# EAGLE design sk6812-24-12ring-in (EAGLE 7.5.0)
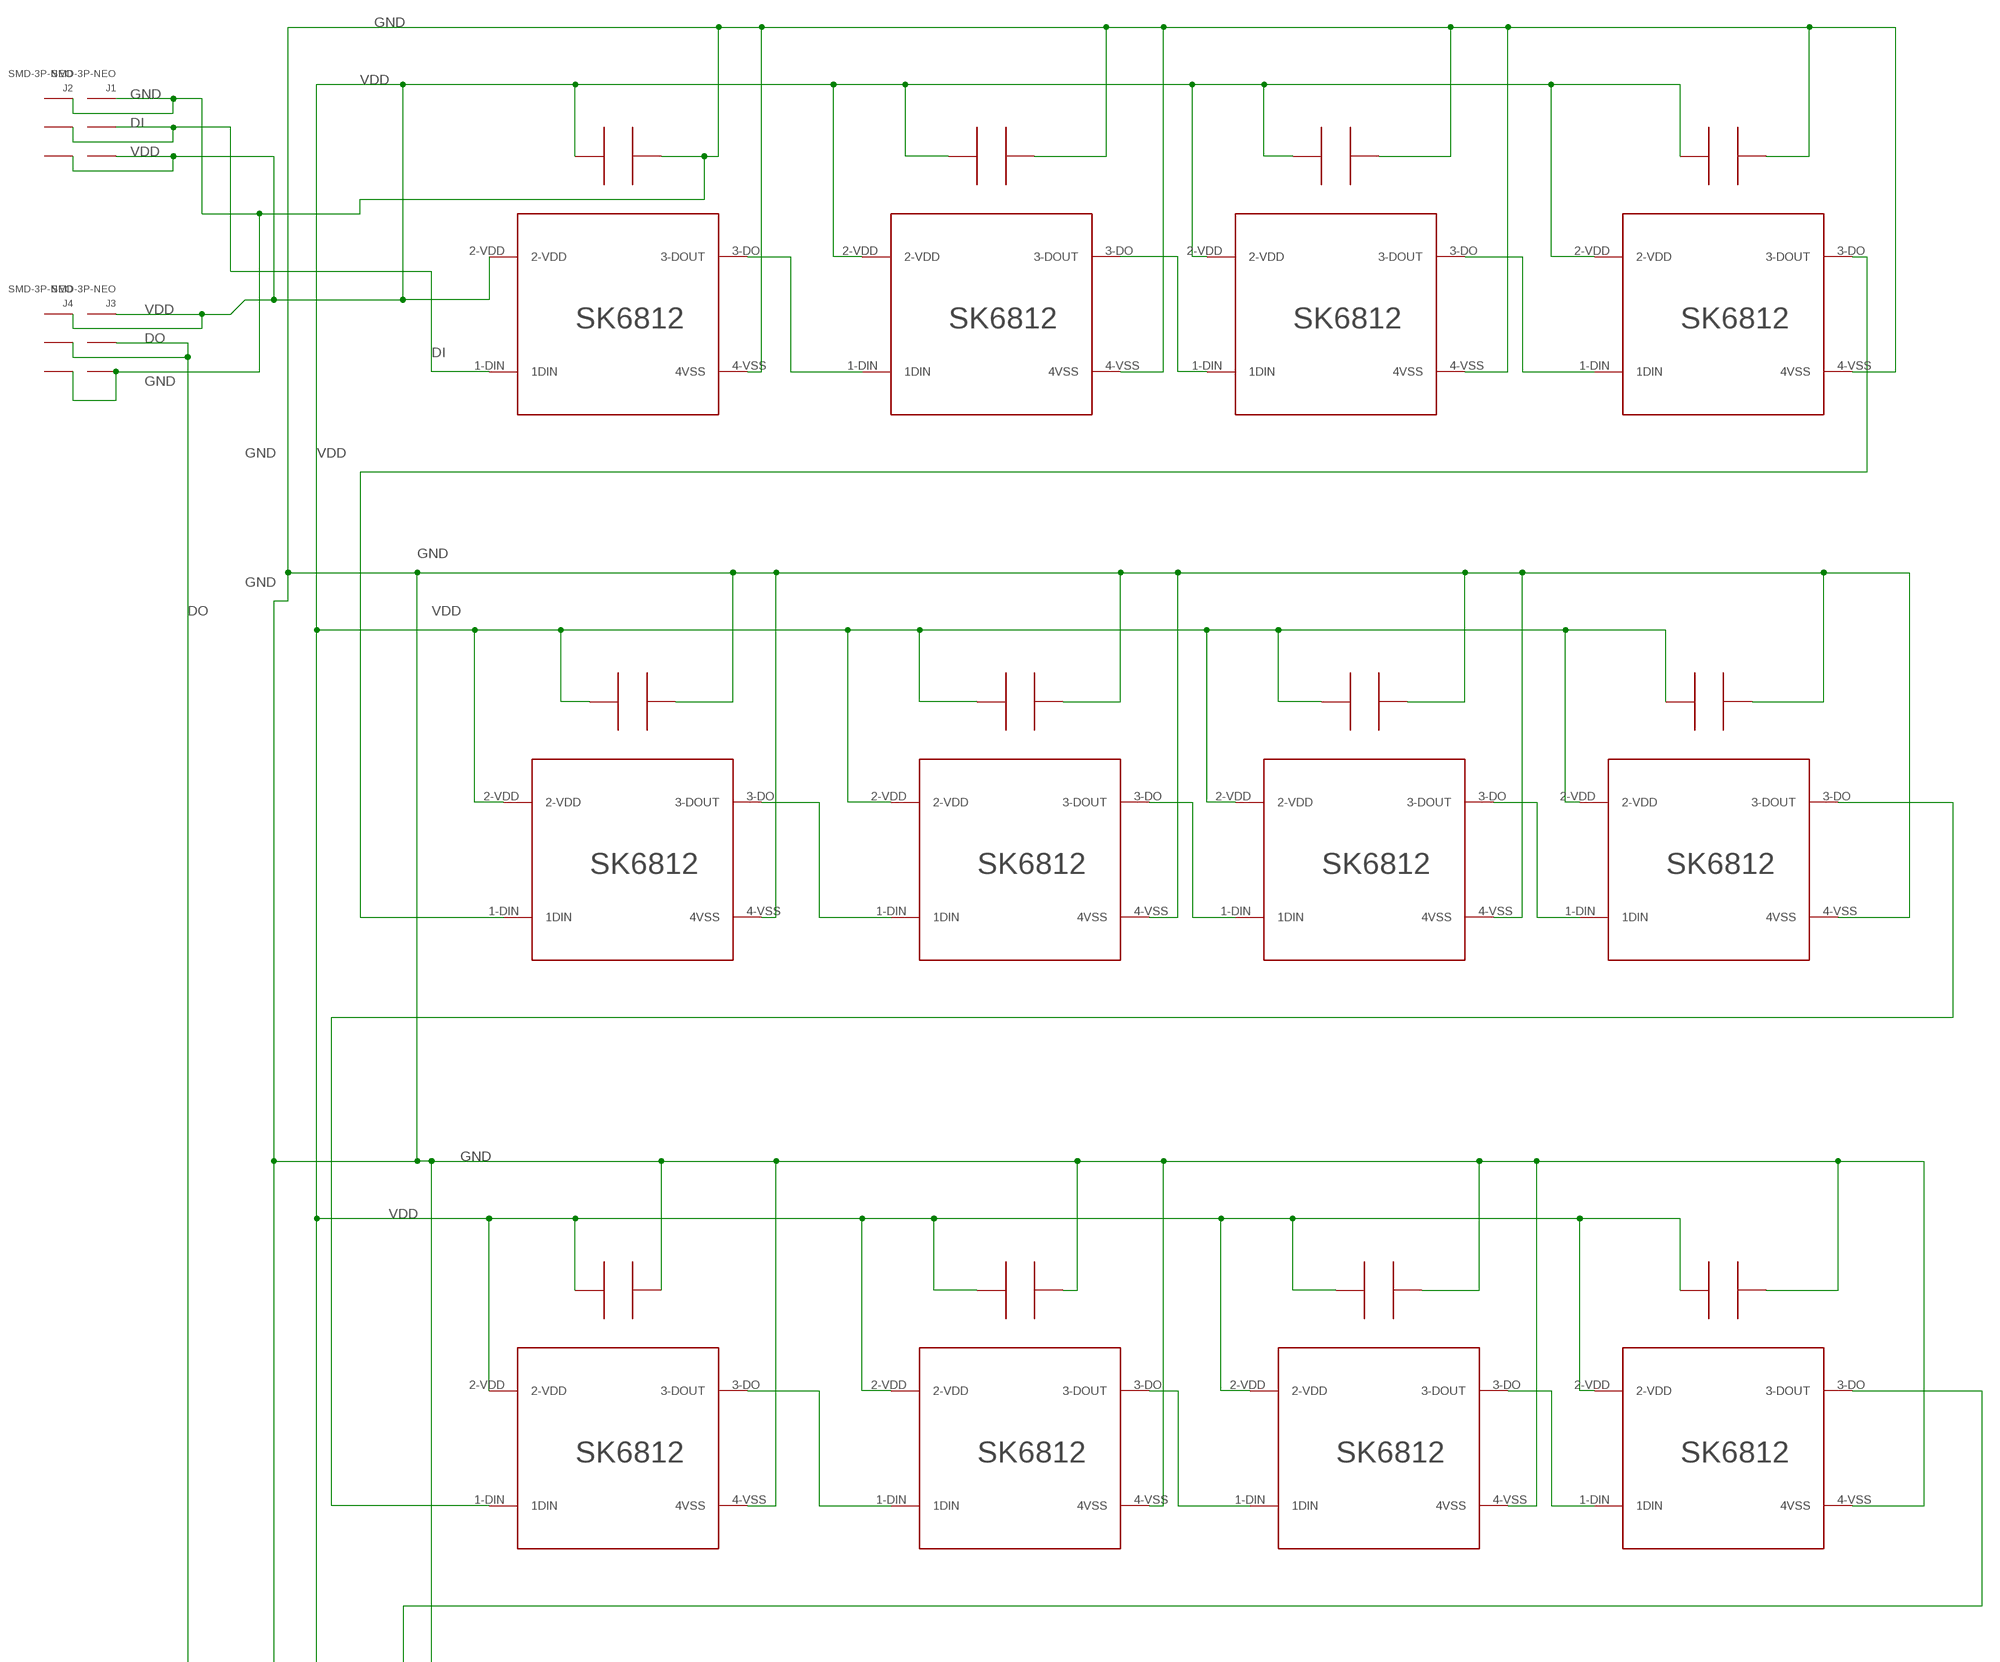
[diagram p0: schematic, sheet 1, part 1 of 2]
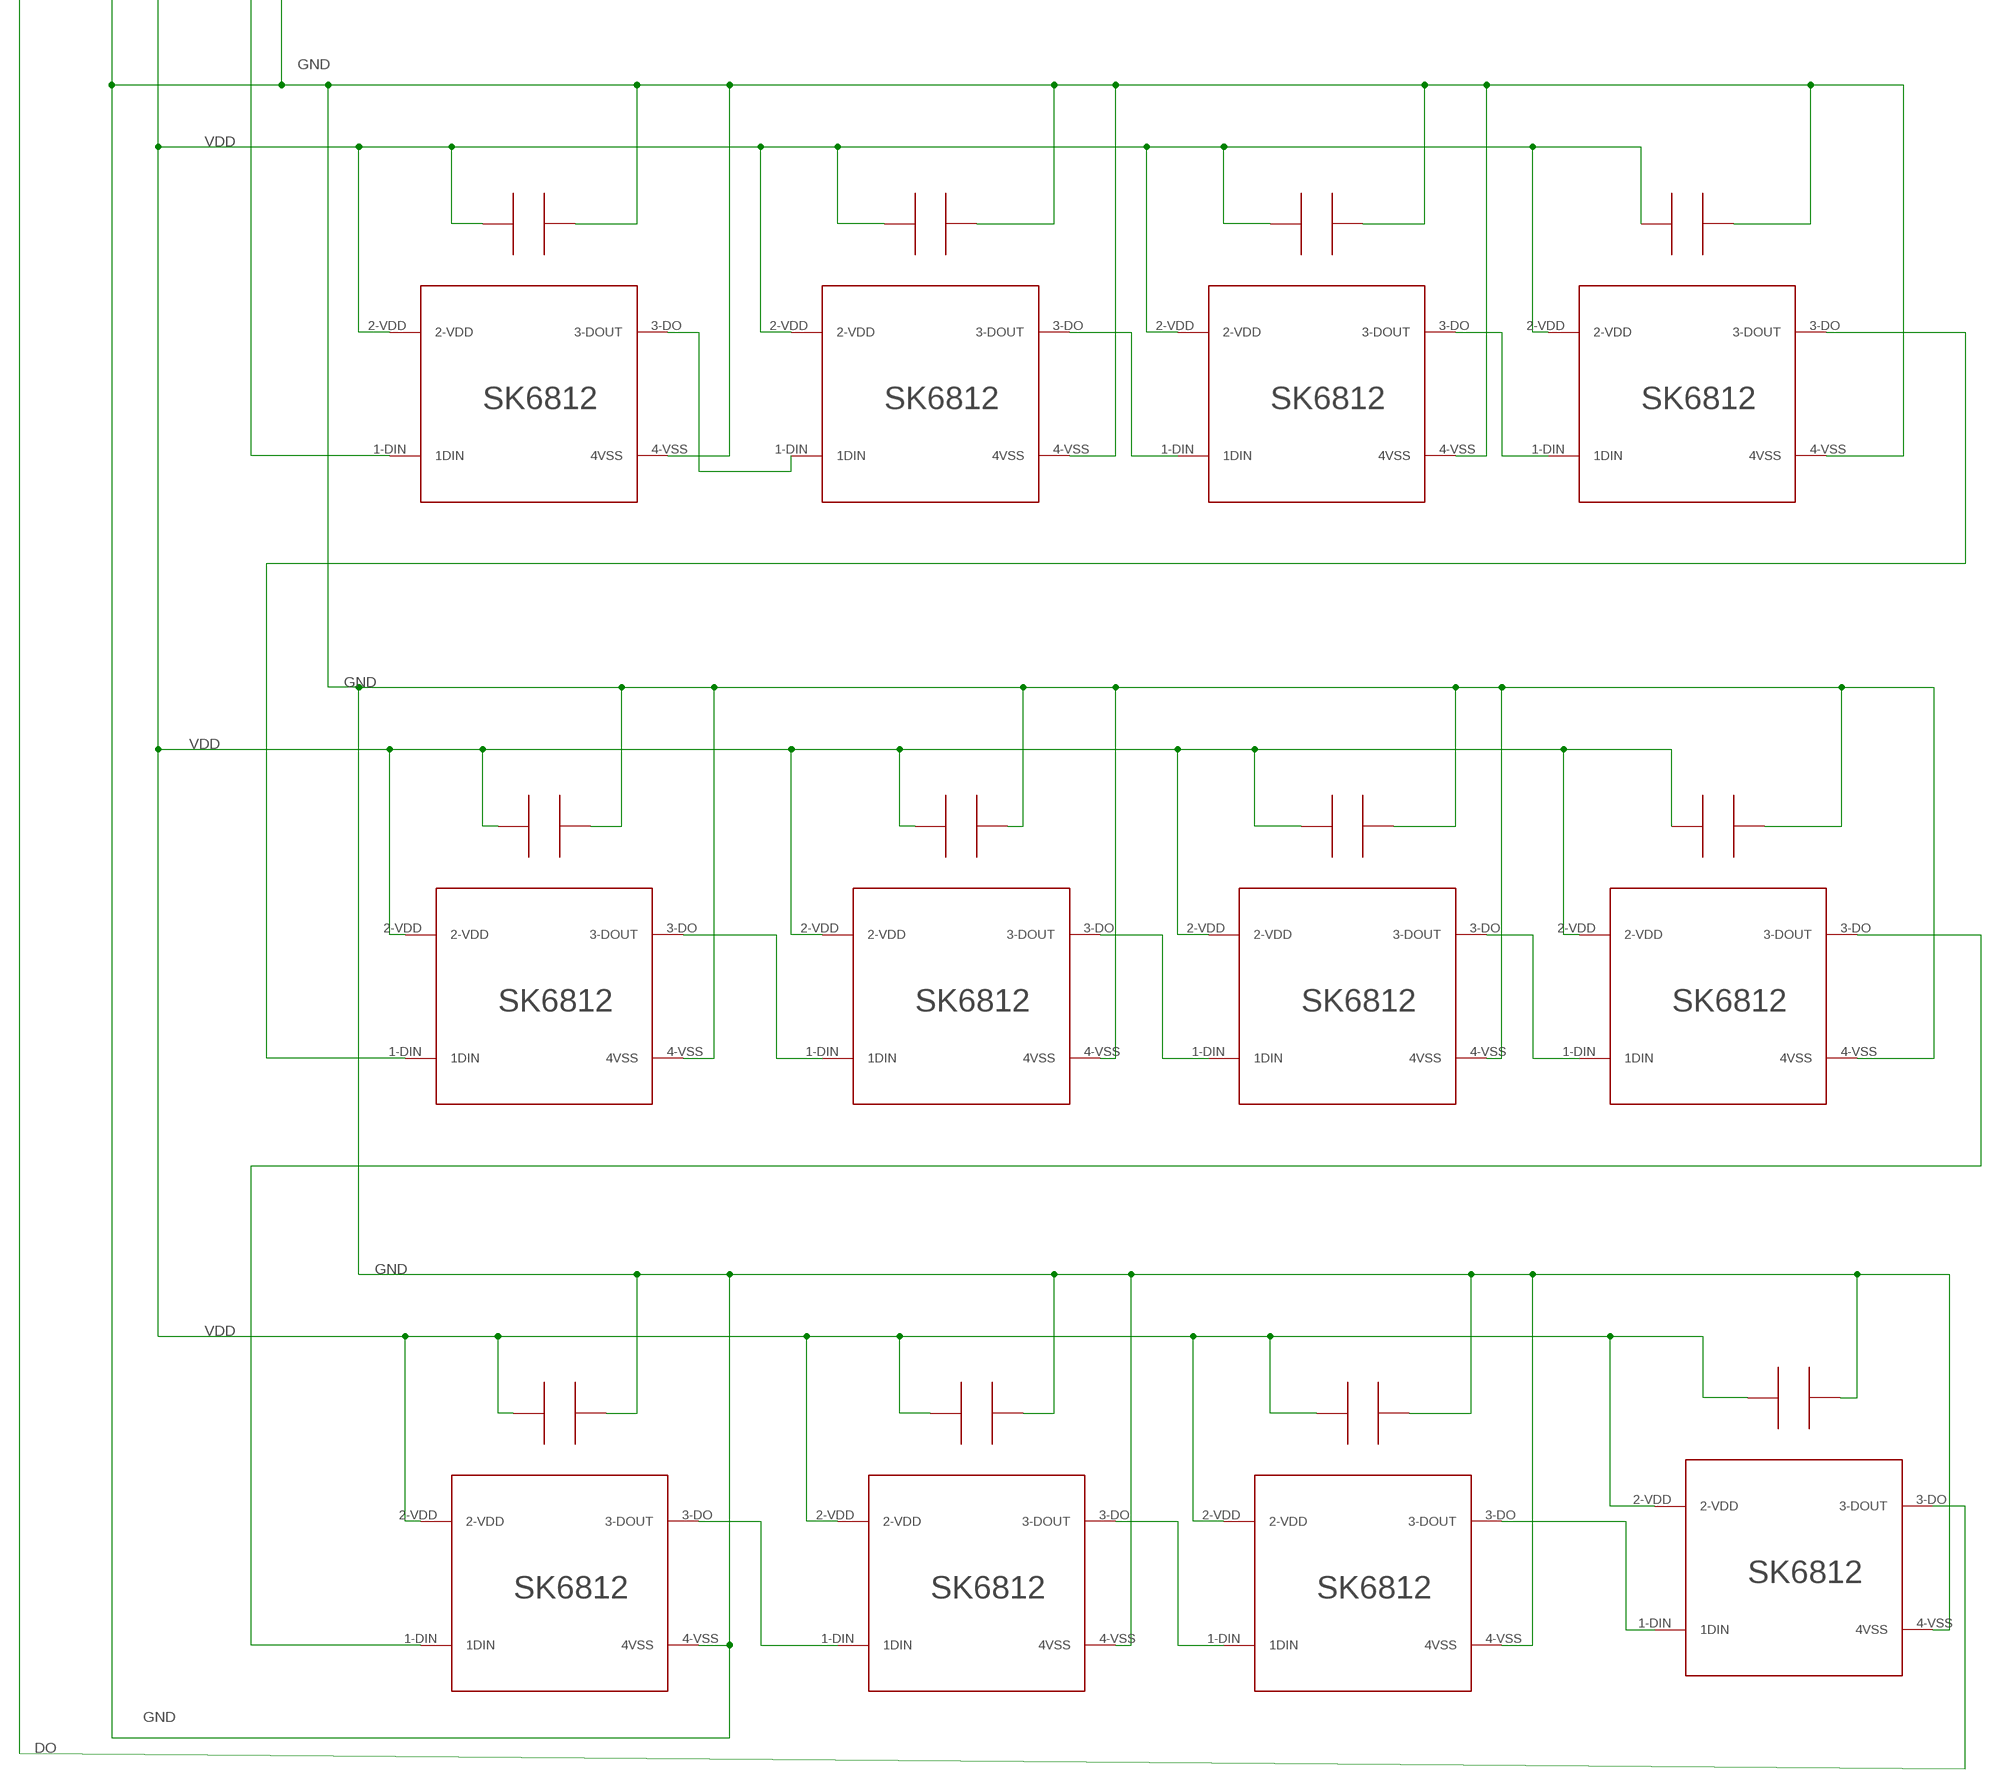
[diagram p1: schematic, sheet 1, part 2 of 2]

## Parts
D1  SK6812-S-C  [SMD4020+0402C]
D2  SK6812-S-C  [SMD4020+0402C]
D3  SK6812-S-C  [SMD4020+0402C]
D4  SK6812-S-C  [SMD4020+0402C]
D5  SK6812-S-C  [SMD4020+0402C]
D6  SK6812-S-C  [SMD4020+0402C]
D7  SK6812-S-C  [SMD4020+0402C]
D8  SK6812-S-C  [SMD4020+0402C]
D9  SK6812-S-C  [SMD4020+0402C]
D10  SK6812-S-C  [SMD4020+0402C]
D11  SK6812-S-C  [SMD4020+0402C]
D12  SK6812-S-C  [SMD4020+0402C]
D13  SK6812-S-C  [SMD4020+0402C]
D14  SK6812-S-C  [SMD4020+0402C]
D15  SK6812-S-C  [SMD4020+0402C]
D16  SK6812-S-C  [SMD4020+0402C]
D17  SK6812-S-C  [SMD4020+0402C]
D18  SK6812-S-C  [SMD4020+0402C]
D19  SK6812-S-C  [SMD4020+0402C]
D20  SK6812-S-C  [SMD4020+0402C]
D21  SK6812-S-C  [SMD4020+0402C]
D22  SK6812-S-C  [SMD4020+0402C]
D23  SK6812-S-C  [SMD4020+0402C]
D24  SK6812-S-C  [SMD4020+0402C]
J1  SMD-3P-NEO  [SMD-3P-2.0]
J2  SMD-3P-NEO  [SMD-3P-2.0]
J3  SMD-3P-NEO  [SMD-3P-2.0]
J4  SMD-3P-NEO  [SMD-3P-2.0]

## Nets
DI: D1.1-DIN(1DIN) J1.P$2 J2.P$2
DO: D24.3-DO(3-DOUT) J3.P$2 J4.P$2
DO01: D1.3-DO(3-DOUT) D2.1-DIN(1DIN)
DO02: D2.3-DO(3-DOUT) D3.1-DIN(1DIN)
DO03: D3.3-DO(3-DOUT) D4.1-DIN(1DIN)
DO04: D4.3-DO(3-DOUT) D5.1-DIN(1DIN)
DO05: D5.3-DO(3-DOUT) D6.1-DIN(1DIN)
DO06: D6.3-DO(3-DOUT) D7.1-DIN(1DIN)
DO07: D7.3-DO(3-DOUT) D8.1-DIN(1DIN)
DO08: D8.3-DO(3-DOUT) D9.1-DIN(1DIN)
DO09: D9.3-DO(3-DOUT) D10.1-DIN(1DIN)
DO10: D10.3-DO(3-DOUT) D11.1-DIN(1DIN)
DO11: D11.3-DO(3-DOUT) D12.1-DIN(1DIN)
DO12: D12.3-DO(3-DOUT) D13.1-DIN(1DIN)
DO13: D13.3-DO(3-DOUT) D14.1-DIN(1DIN)
DO14: D14.3-DO(3-DOUT) D15.1-DIN(1DIN)
DO15: D15.3-DO(3-DOUT) D16.1-DIN(1DIN)
DO16: D16.3-DO(3-DOUT) D17.1-DIN(1DIN)
DO17: D17.3-DO(3-DOUT) D18.1-DIN(1DIN)
DO18: D18.3-DO(3-DOUT) D19.1-DIN(1DIN)
DO19: D19.3-DO(3-DOUT) D20.1-DIN(1DIN)
DO20: D20.3-DO(3-DOUT) D21.1-DIN(1DIN)
DO21: D21.3-DO(3-DOUT) D22.1-DIN(1DIN)
DO22: D22.3-DO(3-DOUT) D23.1-DIN(1DIN)
DO23: D23.3-DO(3-DOUT) D24.1-DIN(1DIN)
GND: D1.4-VSS(4VSS) D1.5-C-VSS(C-VSS) D2.4-VSS(4VSS) D2.5-C-VSS(C-VSS) D3.4-VSS(4VSS) D3.5-C-VSS(C-VSS) D4.4-VSS(4VSS) D4.5-C-VSS(C-VSS) D5.4-VSS(4VSS) D5.5-C-VSS(C-VSS) D6.4-VSS(4VSS) D6.5-C-VSS(C-VSS) D7.4-VSS(4VSS) D7.5-C-VSS(C-VSS) D8.4-VSS(4VSS) D8.5-C-VSS(C-VSS) D9.4-VSS(4VSS) D9.5-C-VSS(C-VSS) D10.4-VSS(4VSS) D10.5-C-VSS(C-VSS) D11.4-VSS(4VSS) D11.5-C-VSS(C-VSS) D12.4-VSS(4VSS) D12.5-C-VSS(C-VSS) D13.4-VSS(4VSS) D13.5-C-VSS(C-VSS) D14.4-VSS(4VSS) D14.5-C-VSS(C-VSS) D15.4-VSS(4VSS) D15.5-C-VSS(C-VSS) D16.4-VSS(4VSS) D16.5-C-VSS(C-VSS) D17.4-VSS(4VSS) D17.5-C-VSS(C-VSS) D18.4-VSS(4VSS) D18.5-C-VSS(C-VSS) D19.4-VSS(4VSS) D19.5-C-VSS(C-VSS) D20.4-VSS(4VSS) D20.5-C-VSS(C-VSS) D21.4-VSS(4VSS) D21.5-C-VSS(C-VSS) D22.4-VSS(4VSS) D22.5-C-VSS(C-VSS) D23.4-VSS(4VSS) D23.5-C-VSS(C-VSS) D24.4-VSS(4VSS) D24.5-C-VSS(C-VSS) J1.P$3 J2.P$3 J3.P$1 J4.P$1
VDD: D1.2-VDD D1.6-C-VDD(C-VDD) D2.2-VDD D2.6-C-VDD(C-VDD) D3.2-VDD D3.6-C-VDD(C-VDD) D4.2-VDD D4.6-C-VDD(C-VDD) D5.2-VDD D5.6-C-VDD(C-VDD) D6.2-VDD D6.6-C-VDD(C-VDD) D7.2-VDD D7.6-C-VDD(C-VDD) D8.2-VDD D8.6-C-VDD(C-VDD) D9.2-VDD D9.6-C-VDD(C-VDD) D10.2-VDD D10.6-C-VDD(C-VDD) D11.2-VDD D11.6-C-VDD(C-VDD) D12.2-VDD D12.6-C-VDD(C-VDD) D13.2-VDD D13.6-C-VDD(C-VDD) D14.2-VDD D14.6-C-VDD(C-VDD) D15.2-VDD D15.6-C-VDD(C-VDD) D16.2-VDD D16.6-C-VDD(C-VDD) D17.2-VDD D17.6-C-VDD(C-VDD) D18.2-VDD D18.6-C-VDD(C-VDD) D19.2-VDD D19.6-C-VDD(C-VDD) D20.2-VDD D20.6-C-VDD(C-VDD) D21.2-VDD D21.6-C-VDD(C-VDD) D22.2-VDD D22.6-C-VDD(C-VDD) D23.2-VDD D23.6-C-VDD(C-VDD) D24.2-VDD D24.6-C-VDD(C-VDD) J1.P$1 J2.P$1 J3.P$3 J4.P$3

## Library data of the parts
D1-D24 = hh-led-2017:SK6812-S-C
J1-J4 = hh-led-2017:SMD-3P-NEO

## Board
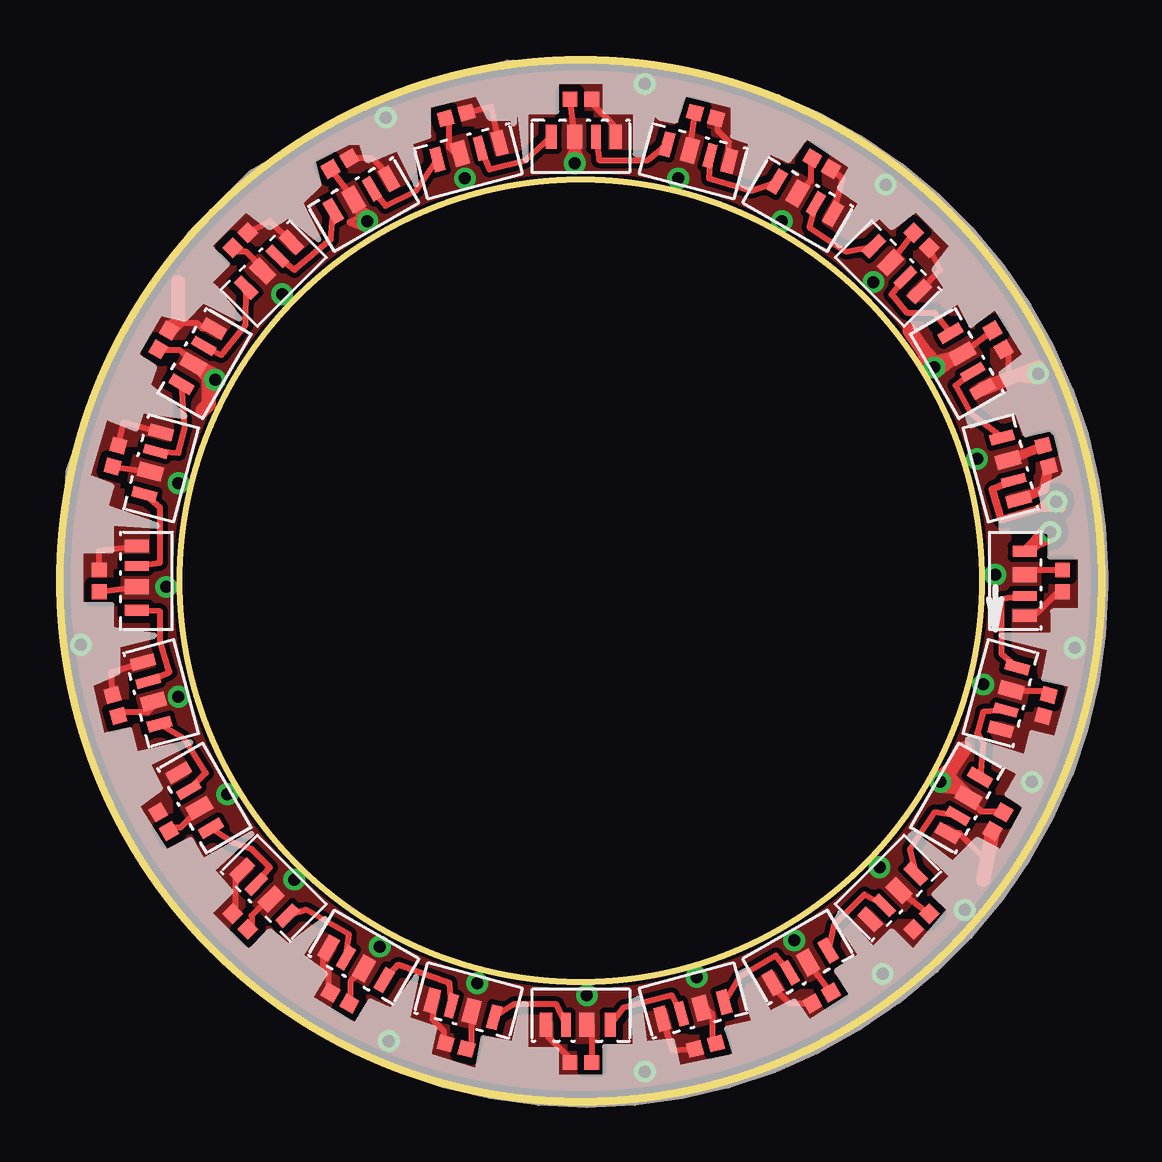
[diagram p2: board, top side]
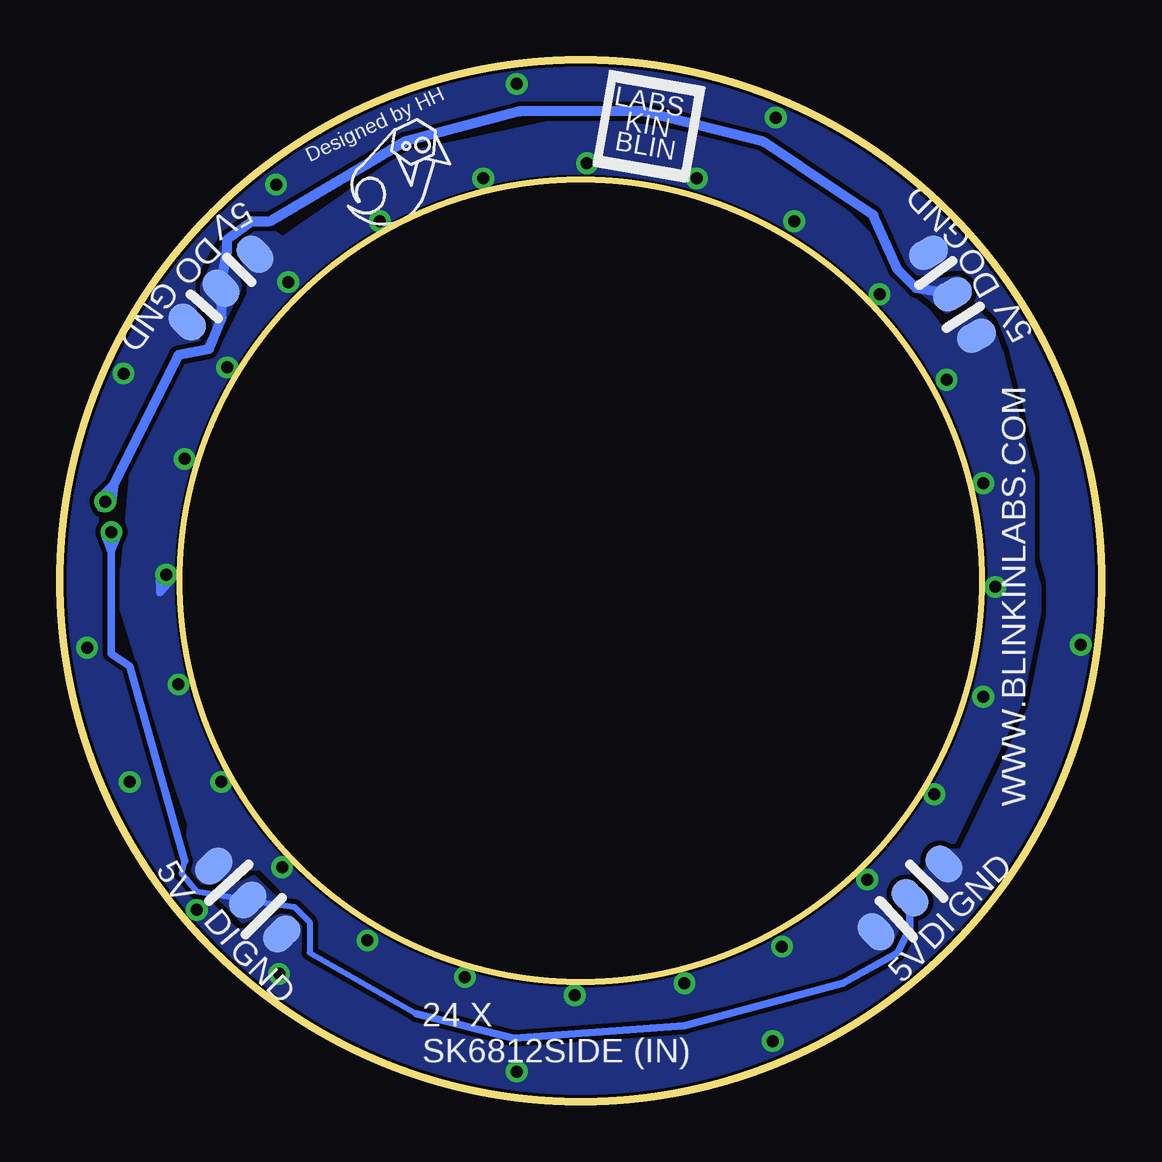
[diagram p3: board, bottom side, seen from below]

Size 43.4 x 43.4 mm. Coordinates in mm from the lower left corner, seen from the top.
Outline: circle at 21.7,21.7 radius 21.7
Outline: circle at 21.7,21.7 radius 16.7
Copper layers (1*16): Top 0.035mm / dielectric 1.5mm / Bottom 0.035mm
Design rules "default *": minimum track width 10mil, minimum drill 24mil, track to track 8mil, track to pad 8mil, pad to pad 8mil, via to via 8mil, smd to smd 8mil, copper to edge 4mil, drill to drill 8mil, minimum pad ring 10mil, minimum via ring 8mil, stop-mask expansion 4mil, vias tented up to drill 25mil, thermal gap 10mil

### Footprints (pad centres in the part's own frame; a part is rotated, then mirrored left to right if it is on the bottom)
SMD4020+0402C = smd 1.016 x 0.457: 1-DIN -0.3,1.225 | smd 1.016 x 0.61: 2-VDD -0.3,0.25 | smd 1.016 x 0.4: 3-DO -0.3,-0.625 | smd 1.016 x 0.508: 4-VSS -0.3,-1.45 | smd 0.62 x 0.62: 5-C-VSS 1.27,-0.45; 6-C-VDD 1.27,0.45
SMD-3P-2.0 = smd 1.2 x 1.676: P$1 -2,0; P$2 0,0; P$3 2,0

### Placement (x,y rotation side)
D1  40.5,21.7 0 top
D2  39.86,16.83 345 top
D3  37.98,12.3 330 top
D4  34.99,8.41 315 top
D5  31.1,5.42 300 top
D6  26.57,3.54 285 top
D7  21.7,2.9 270 top
D8  16.83,3.54 255 top
D9  12.3,5.42 240 top
D10  8.41,8.41 225 top
D11  5.42,12.3 210 top
D12  3.54,16.83 195 top
D13  2.9,21.7 180 top
D14  3.54,26.57 165 top
D15  5.42,31.1 150 top
D16  8.41,34.99 135 top
D17  12.3,37.98 120 top
D18  16.83,39.86 105 top
D19  21.7,40.5 90 top
D20  26.57,39.86 75 top
D21  31.1,37.98 60 top
D22  34.99,34.99 45 top
D23  37.98,31.1 30 top
D24  39.86,26.57 15 top
J1  35.58,8.4 315 bottom
J2  7.98,8.49 45 bottom
J3  36.69,33.89 45 bottom
J4  6.21,33.64 300 bottom
U$1  [CRAZYCAT(M)]  29.19,39.23 205 bottom
U$2  [LOGO(M)]  18.14,40.75 170 bottom

### Tracks (layer width: path | path; a pad name or v marks a point on that pad's centre or on a via)
DI  (via drill 0.5 pad 0.25)
  Top 0.305: v41.26,23.73 40.73,23.2 | 40.73,23.2 40.69,23.17 | 40.69,23.17 40.45,22.93 D1.1-DIN | 40.69,23.17 40.74,23.19 | 40.69,23.17 40.71,23.22 | 40.73,23.2 41.37,23.45 v41.26,23.73 | 40.73,23.2 40.98,23.84 v41.26,23.73 | 40.74,23.19 41.38,23.45 v41.26,23.73 | 40.74,23.19 40.97,23.83 v41.26,23.73 | 40.71,23.22 41.36,23.45 v41.26,23.73 | 40.71,23.22 40.98,23.85 v41.26,23.73
  Top 0.406: D1.1-DIN 40.58,23.31 | 40.58,23.31 40.62,23.34 | 40.62,23.34 41.01,23.73 v41.26,23.73 | 40.58,23.31 41.32,23.49 | 40.58,23.31 40.61,23.35 | 40.61,23.35 41.06,23.89 | 40.63,23.32 41.06,23.88 | 40.61,23.35 | 40.63,23.32 | 40.62,23.34 41.31,23.49 v41.26,23.73 | 40.62,23.34 41.06,23.89 v41.26,23.73 | 40.63,23.32 41.06,23.88 | 40.63,23.32 41.32,23.49 | 41.32,23.49 | v41.26,23.73 41.32,23.49 | 40.63,23.32 41.06,23.88 | v41.26,23.73 41.06,23.88 | 40.63,23.32 41.32,23.49 | v41.26,23.73 41.32,23.49 | 40.63,23.32 41.06,23.88 | v41.26,23.73 41.06,23.88 | 40.61,23.35 41.31,23.49 | 41.31,23.49 | v41.26,23.73 41.31,23.49 | 40.61,23.35 41.06,23.89 | v41.26,23.73 41.06,23.89 | 40.61,23.35 41.31,23.49 | v41.26,23.73 41.31,23.49 | 40.61,23.35 41.06,23.89 | v41.26,23.73 41.06,23.89
  Bottom 0.254: 28.56,3.67 33,6.21 33,7.48 33.64,8.11 J1.P$2 37.7,8.75 38.34,9.51 38.21,10.02
  Bottom 0.305: 41.26,22.93 41.26,18.65 40.5,18.14 38.21,10.02 | 41.26,22.93 41.26,22.98 | 41.26,22.98 | 41.26,22.98 v41.26,23.73 | 41.26,22.93 41.28,22.98 | 41.26,22.93 41.24,22.98 | 41.28,22.98 40.99,23.6 | v41.26,23.73 40.99,23.6 | 41.24,22.98 40.98,23.62 | v41.26,23.73 40.98,23.62 | 28.56,3.67 24.49,2.65 17.38,3.16 10.78,4.94 8.49,6.21 7.98,7.22 J2.P$2 | 41.26,22.98 41.53,23.61 | 41.53,23.61 | v41.26,23.73 41.53,23.61 | 41.26,22.98 40.98,23.61 | 41.26,22.98 41.53,23.61 | 41.53,23.61 | 40.98,23.61 | 41.26,22.98 41.53,23.61 | v41.26,23.73 41.53,23.61 | 41.26,22.98 | 41.26,22.98 40.98,23.61 | 40.98,23.61 | v41.26,23.73 40.98,23.61 | 41.26,22.98 41.53,23.61 | 41.26,22.98 40.98,23.61 | v41.26,23.73 40.98,23.61 | 41.26,22.98 41.53,23.61 | v41.26,23.73 41.53,23.61 | 41.26,22.98 40.98,23.61 | v41.26,23.73 40.98,23.61 | 41.28,22.98 41.54,23.62 v41.26,23.73 | 41.28,22.98 40.99,23.6 | v41.26,23.73 40.99,23.6 | 41.24,22.98 41.53,23.6 v41.26,23.73 | 41.24,22.98 40.98,23.62 | v41.26,23.73 40.98,23.62
  pour Bottom (no thermals): 34.15,8.24 35.29,9.38 36.94,8.62 35.8,7.48
DO  (via drill 0.5 pad 0.25)
  Top 0.305: D24.3-DO 38.84,25.51 39.23,24.24 40.82,24.72 | 40.82,24.72 41,24.77 | 41,24.77 41.05,24.79 | 41.05,24.79 v41.51,25 | 41,24.77 41.74,24.7 | v41.51,25 41.74,24.7 | 41,24.77 41.58,25.24 | 41.58,25.24 | v41.51,25 41.58,25.24 | 41.74,24.7 | 41.04,24.81 41.72,24.7 | 41.72,24.7 | 41.05,24.77 41.74,24.7 | v41.51,25 41.74,24.7 | 41.05,24.77 41.56,25.23 | v41.51,25 41.56,25.23 | 41.04,24.81 | 41.04,24.81 41.72,24.7 | v41.51,25 41.72,24.7 | 41.04,24.81 41.58,25.24 | 41.04,24.81 41.58,25.24 | v41.51,25 41.58,25.24 | 41.05,24.79 41.73,24.7 v41.51,25 | 41.05,24.79 41.57,25.23 v41.51,25 | 41.05,24.77 41.74,24.7 | v41.51,25 41.74,24.7 | 41.05,24.77 41.56,25.23 | v41.51,25 41.56,25.23 | 41.04,24.81 41.72,24.7 | 41.04,24.81 41.58,25.24 | 41.04,24.81 41.72,24.7 | v41.51,25 41.72,24.7 | 41.04,24.81 41.58,25.24 | v41.51,25 41.58,25.24 | 40.82,24.72 41.5,24.7 v41.51,25 | 40.82,24.72 41.3,25.21 v41.51,25
  Bottom 0.305: v41.51,25 41.47,24.98 v41.51,25 | v41.51,25 41.47,24.99 | v41.51,25 41.71,24.72 | v41.51,25 41.47,24.99
  Bottom 0.406: 41.18,25.67 38.46,31.1 37.19,31.35 36.69,32.62 J3.P$2 36.69,34.15 36.43,35.42 36.43,35.92 35.42,36.69 34.65,36.69 29.07,39.99 24.24,41.26 19.16,41.26 14.08,39.99 9.51,36.94 8.49,34.65 7.73,33.89 J4.P$2 | 41.18,25.67 v41.51,25 | 41.18,25.67 41.26,24.97 v41.51,25 | 41.18,25.67 41.69,25.18 v41.51,25
  pour Bottom (no thermals): 7.73,34.15 5.95,34.4 5.95,33.13 6.46,32.88 7.73,33.89
  pour Bottom (isolate 0.254, no thermals): 36.43,35.92 35.92,33.89 37.19,31.35 37.45,34.02
DO01
  Top 0.254: D1.3-DO 39.23,20.94 39.23,18.65 D2.1-DIN
DO02
  Top 0.254: D2.3-DO 38.46,16.24 38.21,15.35 38.46,14.97 D3.1-DIN
DO03
  Top 0.254: D3.3-DO 36.43,12.05 35.42,10.52 D4.1-DIN
DO04
  Top 0.254: D4.3-DO 33.51,8.62 32.24,7.35 D5.1-DIN
DO05
  Top 0.254: D5.3-DO 29.83,6.08 28.3,5.19 D6.1-DIN
DO06
  Top 0.254: D6.3-DO 25.51,4.43 23.48,3.92 D7.1-DIN
DO07
  Top 0.254: D7.3-DO 20.68,4.05 18.91,4.05 D8.1-DIN
DO08
  Top 0.254: D8.3-DO 16.24,4.94 14.08,5.7 D9.1-DIN
DO09
  Top 0.254: D9.3-DO 12.05,6.97 10.27,7.98 D10.1-DIN
DO10
  Top 0.254: D10.3-DO 8.75,9.76 7.98,10.52 7.22,10.78 D11.1-DIN
DO11
  Top 0.254: D11.3-DO 6.08,13.7 5.19,15.1 D12.1-DIN
DO12
  Top 0.254: D12.3-DO 4.55,17.89 4.17,19.16 4.17,20.43 D13.1-DIN
DO13
  Top 0.254: D13.3-DO 4.17,22.46 4.17,24.75 D14.1-DIN
DO14
  Top 0.254: D14.3-DO 4.94,27.03 5.19,28.05 D15.1-DIN
DO15
  Top 0.254: D15.3-DO 6.71,31.1 7.73,32.37 D16.1-DIN
DO16
  Top 0.254: D16.3-DO 9.76,34.65 11.29,35.92 D17.1-DIN
DO17
  Top 0.254: D17.3-DO 13.57,37.32 14.84,37.96 D18.1-DIN
DO18
  Top 0.254: D18.3-DO 17.89,38.84 19.41,39.23 D19.1-DIN
DO19
  Top 0.254: D19.3-DO 22.46,39.23 24.49,39.23 D20.1-DIN
DO20
  Top 0.254: D20.3-DO 27.03,38.46 28.81,37.96 D21.1-DIN
DO21
  Top 0.254: D21.3-DO 31.23,36.43 32.75,35.42 D22.1-DIN
DO22
  Top 0.254: D22.3-DO 34.65,33.64 35.29,32.88 36.43,32.88 D23.1-DIN
DO23
  Top 0.254: D23.3-DO 37.32,29.83 37.96,28.68 D24.1-DIN
GND  (via drill 0.5 pad 0.25)
  Top 0.254: D5.5-C-VSS 31.3,4.1 30.39,4.1 29.7,4.78 D5.4-VSS | D1.5-C-VSS 41.59,21.24 40.67,20.33 40.22,20.33 D1.4-VSS | D8.5-C-VSS 15.98,2.5 15.98,2.95 15.53,3.41 15.53,4.1 D8.4-VSS | D20.5-C-VSS 27.41,40.9 27.41,40.45 27.87,39.99 27.87,39.3 D20.4-VSS | D10.5-C-VSS 7.3,7.98 7.3,9.36 7.53,9.58 D10.4-VSS | D9.5-C-VSS 11.18,4.55 11.18,5.47 10.96,5.7 10.96,6.15 11.18,6.38 D9.4-VSS | D17.5-C-VSS 12.1,39.3 13.01,39.3 13.7,38.62 D17.4-VSS | D7.5-C-VSS 21.24,1.81 20.33,2.73 20.33,3.18 D7.4-VSS | D19.5-C-VSS 22.16,41.59 23.07,40.67 23.07,40.22 D19.4-VSS | D15.4-VSS 6.38,32.22 5.93,32.22 5.7,32.44 5.01,32.44 4.94,32.52 | D3.4-VSS 37.02,11.18 37.47,11.18 38.39,10.27 38.65,10.22 | D23.5-C-VSS 39.53,31.3 39.53,30.39 39.62,30.15 | D6.4-VSS 25.51,2.14 D6.5-C-VSS | D22.4-VSS 36.69,34.65 D22.5-C-VSS | D13.5-C-VSS 1.63,22.97 D13.4-VSS | D12.5-C-VSS 2.14,17.89 D12.4-VSS | D14.5-C-VSS 2.65,28.3 D14.4-VSS | D16.5-C-VSS 8.75,36.69 D16.4-VSS | D18.5-C-VSS 17.96,41.47 D18.4-VSS | D21.5-C-VSS 32.62,38.46 D21.4-VSS
  Top 0.406: D24.4-VSS 41,25.51 D24.5-C-VSS
  Top 0.61: 40.75,30.59 40,30.3 | 40,30.3 39.62,30.15 D23.4-VSS | 38.46,9.25 38.65,10.22 D3.5-C-VSS | 4.94,34.15 4.94,32.52 D15.5-C-VSS | 40.73,30.19 39.95,30.28 40,30.29 | v40.75,30.34 40.73,30.19 | 40.71,30.48 | v40.75,30.34 40.71,30.48 | 40,30.3 40.73,30.19 v40.75,30.34 | 40,30.3 40.71,30.48 v40.75,30.34 | 40.73,30.19 40,30.27 40.71,30.48 | v40.75,30.34 40.73,30.19 | v40.75,30.34 40.71,30.48 | 40,30.29 40.73,30.19 v40.75,30.34 | 40,30.29 40.71,30.48 v40.75,30.34
  other vias: 13.57,41 13.57,41 24.37,42.4 34.4,38.21 42.27,18.91 34.27,5.32 24.37,1.25 13.7,2.52 0.87,19.03 37.7,7.98 40.5,13.32
  pour Top (isolate 0.3, rank 4, no thermals): 22.72,43.54 arc-90 43.54,22.72 43.54,20.94 arc-90 22.46,-0.14 21.19,-0.14 arc-90 0.11,20.94 0.11,21.7 arc-90 21.95,43.54 22.21,43.54
  pour Bottom (isolate 0.125, rank 4, no thermals): 20.94,43.54 arc-90 43.54,20.94 43.54,20.18 arc-90 23.22,-0.14 20.94,-0.14 arc-90 0.11,20.68 0.11,21.45 0.11,23.48 arc-90 19.92,43.29
VDD  (via drill 0.5 pad 0.25)
  Top 0.254: D10.6-C-VDD 7.98,7.3 7.98,7.75 8.67,8.44 D10.2-VDD | D12.6-C-VDD 2.5,16.21 3.64,16.21 3.87,16.44 D12.2-VDD | D9.6-C-VDD 12.1,4.1 12.1,5.01 12.56,5.47 D9.2-VDD | D21.6-C-VDD 31.3,39.3 31.3,38.39 30.84,37.93 D21.2-VDD | D8.6-C-VDD 17.13,2.27 17.13,3.64 D8.2-VDD | D16.6-C-VDD 7.3,35.42 7.75,35.42 8.44,34.73 D16.2-VDD | D7.6-C-VDD 22.16,1.81 22.16,3.18 D7.2-VDD | D15.6-C-VDD 4.1,31.3 5.01,31.3 5.47,30.84 D15.2-VDD | D1.6-C-VDD 41.59,22.16 40.22,22.16 D1.2-VDD | D2.6-C-VDD 41.13,17.13 39.76,17.13 D2.2-VDD | D6.6-C-VDD 27.19,2.5 27.19,3.64 26.96,3.87 D6.2-VDD | D18.6-C-VDD 16.21,40.9 16.21,39.76 16.44,39.53 D18.2-VDD | D3.6-C-VDD 39.3,12.1 38.39,12.1 37.93,12.56 D3.2-VDD | D11.6-C-VDD 4.55,11.41 5.01,11.41 5.7,12.1 D11.2-VDD | D22.2-VDD D22.6-C-VDD | D23.6-C-VDD D23.2-VDD | D4.2-VDD D4.6-C-VDD | D5.2-VDD D5.6-C-VDD | D13.6-C-VDD D13.2-VDD | D14.6-C-VDD D14.2-VDD | D17.6-C-VDD D17.2-VDD 12.41,37.32 | D19.6-C-VDD D19.2-VDD 21.45,39.85 | D20.2-VDD D20.6-C-VDD | v12.81,36.69 12.41,37.32 | v21.45,39.1 21.45,39.85 | 12.41,37.32 12.98,36.96 | v12.81,36.69 12.98,36.96 | 12.39,37.31 12.38,37.36 12.43,37.33 | 21.15,39.23 21.45,39.9 21.47,39.85 | 21.15,39.23 | 12.43,37.33 12.48,36.66 | 12.43,37.33 12.99,36.96 | 12.99,36.96 | v12.81,36.69 12.99,36.96 | 21.47,39.85 21.16,39.25 | 21.16,39.25 | 12.48,36.66 | 12.41,37.32 | 12.41,37.32 12.98,36.96 | 21.74,39.25 | 12.43,37.33 12.48,36.66 | v12.81,36.69 12.48,36.66 | 12.43,37.33 12.48,36.66 | v12.81,36.69 12.48,36.66 | 12.43,37.33 12.99,36.96 | v12.81,36.69 12.99,36.96 | v12.81,36.69 12.68,36.38 12.06,36.64 12.65,36.97 v12.81,36.69 | 12.41,37.32 12.49,36.65 | 12.49,36.65 | v12.81,36.69 12.49,36.65
  Top 0.254: 12.41,37.32 12.98,36.96 | v12.81,36.69 12.98,36.96 | 12.41,37.32 12.49,36.65 | v12.81,36.69 12.49,36.65 | 12.41,37.32 12.98,36.96 | v12.81,36.69 12.98,36.96 | 12.39,37.31 12.49,36.64 v12.81,36.69 | 12.39,37.31 12.97,36.97 v12.81,36.69 | 21.43,39.85 21.74,39.25 | v21.45,39.1 21.74,39.25 | 21.45,39.85 21.15,39.24 v21.45,39.1 | 21.45,39.85 21.74,39.24 v21.45,39.1 | 21.43,39.85 21.15,39.23 | v21.45,39.1 21.15,39.23 | 21.43,39.85 21.74,39.25 | v21.45,39.1 21.74,39.25 | 21.47,39.85 21.16,39.25 | v21.45,39.1 21.16,39.25 | 21.47,39.85 21.74,39.23 v21.45,39.1
  Top 0.406: D24.2-VDD D24.6-C-VDD
  Top 0.61: 35.42,32.11 35.99,31.26 | 35.99,31.26 36.02,31.21 | 36.02,31.21 v36.43,30.59 | v36.43,30.59 37.1,30.92 | 37.1,30.92 37.15,30.95 | 37.15,30.95 D23.2-VDD | 37.7,14.71 36.94,13.57 37.41,13.11 | 37.41,13.11 D3.2-VDD | 5.95,28.81 6.21,29.07 6.21,29.38 | 6.21,29.38 6.21,30.34 5.87,30.54 | 5.87,30.54 D15.2-VDD | 36.02,31.21 36.3,30.53 | v36.43,30.59 36.3,30.53 | 36.02,31.21 36.54,30.7 | 35.99,31.26 36.3,30.53 | 35.99,31.26 36.54,30.69 | 36.54,30.69 | v36.43,30.59 36.54,30.69 | 37.15,30.95 36.39,30.73 | 37.15,30.95 37.11,30.91 | 37.11,30.91 36.52,30.47 | v36.43,30.59 36.52,30.47 | 36.02,31.21 | 36.02,31.21 36.3,30.53 | 36.01,31.21 36.53,30.7 | v36.43,30.59 36.53,30.7 | 36.02,31.22 36.54,30.69 | 37.1,30.93 36.39,30.73 | 36.39,30.73 | 37.1,30.93 36.52,30.47 | v36.43,30.59 36.52,30.47 | 36.02,31.22 | 36.02,31.22 36.29,30.54 | 36.02,31.21 36.3,30.53 | v36.43,30.59 36.3,30.53 | 36.02,31.21 36.54,30.7 | v36.43,30.59 36.54,30.7 | 36.02,31.21 36.3,30.53 | v36.43,30.59 36.3,30.53 | 36.02,31.21 36.54,30.7 | v36.43,30.59 36.54,30.7 | 37.1,30.92 36.39,30.73 v36.43,30.59 | 37.1,30.92 36.52,30.47 v36.43,30.59 | 36.01,31.21 36.3,30.53 | v36.43,30.59 36.3,30.53 | 36.01,31.21 36.53,30.7 | v36.43,30.59 36.53,30.7 | 36.02,31.22 36.29,30.54 | v36.43,30.59 36.29,30.54 | 36.02,31.22 36.54,30.69 | v36.43,30.59 36.54,30.69 | 36.02,31.22 36.29,30.54 | v36.43,30.59 36.29,30.54 | 36.02,31.22 36.54,30.69 | v36.43,30.59 36.54,30.69 | 37.1,30.93 36.39,30.73 | v36.43,30.59 36.39,30.73 | 37.1,30.93 36.52,30.47 | v36.43,30.59 36.52,30.47 | 37.11,30.91 36.4,30.73 v36.43,30.59 | 37.11,30.91 36.52,30.47 | v36.43,30.59 36.52,30.47 | v36.69,13.32 36.59,13.43 37.16,13.9 36.82,13.25 v36.69,13.32 | 37.41,13.11 36.75,13.45 v36.69,13.32
  Top 0.61: 37.41,13.11 36.67,13.17 v36.69,13.32 | 6.21,29.38 6.59,30 v6.46,30.08 | 6.21,29.38 6.31,30.1 v6.46,30.08 | 5.87,30.54 6.35,29.98 v6.46,30.08 | 5.87,30.54 6.53,30.21 v6.46,30.08
  Bottom 0.305: 39.24,21.25 39.23,21.2 38.75,21.76 | 39.27,21.94 | v38.97,21.95 39.27,21.94 | 39.24,21.25 38.76,21.74 | v38.97,21.95 38.76,21.74 | 39.2,21.24 39.27,21.92 | 39.27,21.92 | v38.97,21.95 39.27,21.93 39.22,21.25 38.75,21.75 v38.97,21.95 | 39.24,21.25 39.27,21.94 | v38.97,21.95 39.27,21.94 | 39.24,21.25 38.76,21.74 | v38.97,21.95 38.76,21.74 | 39.2,21.24 39.27,21.92 | v38.97,21.95 39.27,21.92 | 39.2,21.24 38.75,21.76 | v38.97,21.95 38.75,21.76
  other vias: 30.08,36.69 30.59,6.71 21.95,4.43 13.32,6.46 4.43,21.45 6.97,12.81 9.76,9.25 26.53,5.19 34.15,9.76 38.46,17.38 33.89,34.15 25.76,38.46 16.87,38.46 9.25,33.64 4.94,25.76 4.94,16.87 38.21,26.78 17.38,4.94
  pour Top (isolate 0.15, rank 2, no thermals): 19.92,39.48 20.94,39.48 21.06,40.88 21.83,40.88 21.95,39.73 23.99,39.73 25.51,39.23 26.02,40.37 26.78,40.11 26.53,38.84 29.95,37.58 30.59,38.72 31.61,38.08 30.97,37.07 33.77,34.91 34.53,35.67 35.16,35.03 34.4,34.02 36.81,31.35 37.83,31.86 38.46,30.97 37.45,30.34 38.84,27.16 39.99,27.41 40.24,26.53 38.97,26.02 39.73,22.46 40.75,22.46 40.75,21.57 39.61,21.57 39.23,17.89 40.37,17.51 40.11,16.49 38.97,16.87 37.7,13.44 38.59,12.68 38.21,11.92 36.69,12.56 35.03,9.63 35.8,8.75 35.16,7.98 34.27,8.87 31.35,6.71 31.86,5.44 31.23,5.06 30.34,6.21 27.03,4.81 27.41,3.41 26.4,3.16 26.02,4.55 22.59,3.92 22.46,2.52 21.45,2.52 21.45,3.92 17.76,4.3 17.51,3.03 16.49,3.29 16.87,4.55 13.44,5.82 12.94,4.81 11.92,5.32 12.43,6.46 9.63,8.49 8.75,7.6 8.11,8.24 8.87,9.13 6.59,12.17 5.57,11.54 5.06,12.3 5.95,12.94 4.55,16.11 3.54,15.98 3.29,16.87 4.3,17.25 3.79,20.81 2.65,20.81 2.65,21.83 3.79,21.95 4.17,25.38 2.9,25.76 3.16,26.91 4.68,26.53 5.82,29.7 4.81,30.46 5.32,31.35 6.59,30.72 8.49,33.77 7.6,34.53 8.36,35.29 9.25,34.53 12.05,36.81 11.41,37.83 12.3,38.34 12.94,37.32 16.24,38.84 15.98,39.99 16.87,40.24 17.38,38.97 19.16,39.23
  pour Bottom (rank 2, no thermals): 21.19,41 14.08,39.73 10.52,36.94 9.25,35.67 8.75,34.91 6.46,31.86 5.19,32.88 4.68,32.37 4.17,31.1 2.9,26.02 2.9,22.46 2.65,21.45 2.65,20.43 3.41,16.62 6.21,10.78 6.71,11.03 9,8.49 8.24,7.48 8.75,6.46 11.54,4.94 21.19,2.9 22.46,2.65 28.56,3.67 33.13,6.21 33.13,7.48 35.67,9.76 37.45,9 38.21,10.27 37.96,11.54 38.72,13.83 41,21.19 41,21.95 40.75,22.21 40.24,27.8 37.96,31.1 36.43,32.37 35.67,33.64 36.69,35.92 35.16,36.69 34.15,35.92 29.07,39.48 21.95,41

### Text on the board
bPlace: 5V | GND | DO | GND | DO | 5V | WWW.BLINKINLABS.COM | 5V | GND | DI | DI | GND | 5V | 24 X / SK6812SIDE (IN)